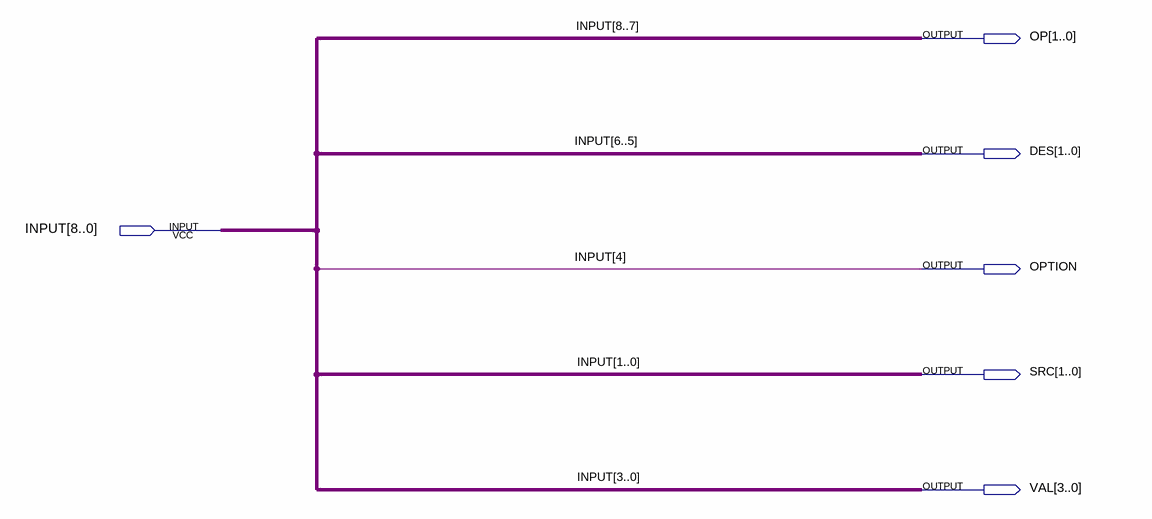
[diagram p0: schematic sheet]
// Quartus schematic EcuDecoder.bdf as structural Verilog: 0 symbols, 6 pins
module EcuDecoder (
  input  [8:0] INPUT,
  output [1:0] OP,
  output [1:0] DES,
  output OPTION,
  output [1:0] SRC,
  output [3:0] VAL
);


  assign DES = INPUT[6:5];
  assign OP = INPUT[8:7];
  assign OPTION = INPUT[4];
  assign SRC = INPUT[1:0];
  assign VAL = INPUT[3:0];
endmodule
